# Altium schematic sheet GNNS (SAM-M10Q-00B).SchDoc
size A; SheetNumber: 6; SheetTotal: 9
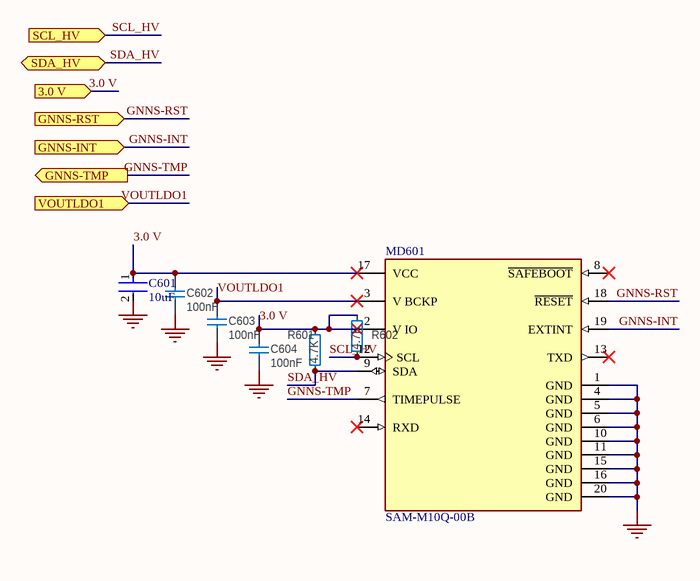
[diagram p0: GNNS (SAM-M10Q-00B).SchDoc]

## Parts
C601  10uF  [FP-GRM188-0_2-MFG]
C602  100nF  [CAPC0603X03L_C]
C603  100nF  [CAPC0603X03L_C]
C604  100nF  [CAPC0603X03L_C]
MD601  SAM-M10Q-00B  [FP-SAM-M10Q-00B-MFG]
R601  4.7K  [RESC0603X03L_C]
R602  4.7K  [RESC0603X03L_C]

## Ports
3.0 V (in, see Digital_Watch[3C], Level Shifter (PCA9306JKZ)[2B], MCU (nrf5340)[2A], PMIC (nPM1300)[3B]), GNNS-INT (in, see Digital_Watch[2C], MCU (nrf5340)[3D]), GNNS-RST (in, see Digital_Watch[2C], MCU (nrf5340)[3D]), GNNS-TMP (out, see Digital_Watch[2C], MCU (nrf5340)[3D]), SCL_HV (in, see Digital_Watch[3C], Level Shifter (PCA9306JKZ)[3B]), SDA_HV (bidir, see Digital_Watch[3C], Level Shifter (PCA9306JKZ)[3B]), VOUTLDO1 (in, see Digital_Watch[2C], PMIC (nPM1300)[3C])

## Nets
GND: C601.2 C602.1 C603.1 C604.1 MD601.1(GND) MD601.4(GND) MD601.5(GND) MD601.6(GND) MD601.10(GND) MD601.11(GND) MD601.15(GND) MD601.16(GND) MD601.20(GND)
3.0 V: C601.1 C602.2 C604.2 MD601.2(V_IO) MD601.17(VCC) R601.1 R602.1 ; port 3.0 V
GNNS-INT: MD601.19(EXTINT) ; port GNNS-INT
GNNS-RST: MD601.18(~{RESET}) ; port GNNS-RST
GNNS-TMP: MD601.7(TIMEPULSE) ; port GNNS-TMP
SCL_HV: MD601.12(SCL) R602.2 ; port SCL_HV
SDA_HV: MD601.9(SDA) R601.2 ; port SDA_HV
VOUTLDO1: C603.2 MD601.3(V_BCKP) ; port VOUTLDO1

Not connected (* = marked no-connect by the designer): MD601 8(~{SAFEBOOT})* 13(TXD)* 14(RXD)*

## Library data of the parts
C601 = CMP-2006-02520-2: Chip Multilayer Ceramic Capacitors for General Purpose, 0603, 10uF, X5R, 15%, 20%, 25V; Tolerance: 20%; Resistor Type: Ceramic; Voltage: 25V; Max Operating Temperature: 85°C; Min Operating Temperature: -55°C; Capacitance: 10uF; Dielectric: X5R; Lead Free: Lead Free; REACH SVHC: No SVHC; Case/Package: 0603; Mount: Surface Mount; Voltage Rating (DC): 25V; Height: 0.8mm; Length: 1.6mm; Thickness: 0.031inch; Width: 0.031inch; Termination: SMD/SMT; Case Code (Imperial): 0603; Case Code (Metric): 1608; Package Quantity: 1; Packaging: Tape and Reel; Depth: 0.8mm; Voltage Rating: 25V; Weight: 0.000222oz; Number of Pins: 2
C602-C604 = C0201-100n-16V-X7S: Capacitor, X7S, ±10%; Pad Count: 2; Value: 100nF; Footprint Doc: 0201; Component Class: Capacitors; Author: rsk
MD601 = CMP-207130-000027-1: M10 GNSS LGA PATCH ANTENNA MOD
R601 R602 = R0201-10k: Resistor, ±1%, 0.05W; Manufacturer: N.A.; Part number IPS: 00000001255; Part number Norautron: 26107101; Part number NEMS: 100100065; Pad Count: 2; Value: 10k; Note: Chip Res 1%; Component Status: Active; Part Number: R0201-10k; PartId: 100100065; Component Class: Resistors; Author: rsk; Manufacturer Part Number: N.A.; ComponentLink1URL: N.A.; ComponentLink1Description: Datasheet; ComponentLink2URL: N.A.; ComponentLink2Description: Supplier link; HelpURL: N.A.; Footprint Doc: 0201; LatestRevisionDate: 2014-11-13; Published: 2014-11-13; Supplier 1: N.A.; Supplier Part Number 1: N.A.; Supplier 2: N.A.; Supplier Part Number 2: N.A.; Artikkelnr Noca: N.A.